# Altium project TK-KB1.PrjPcb
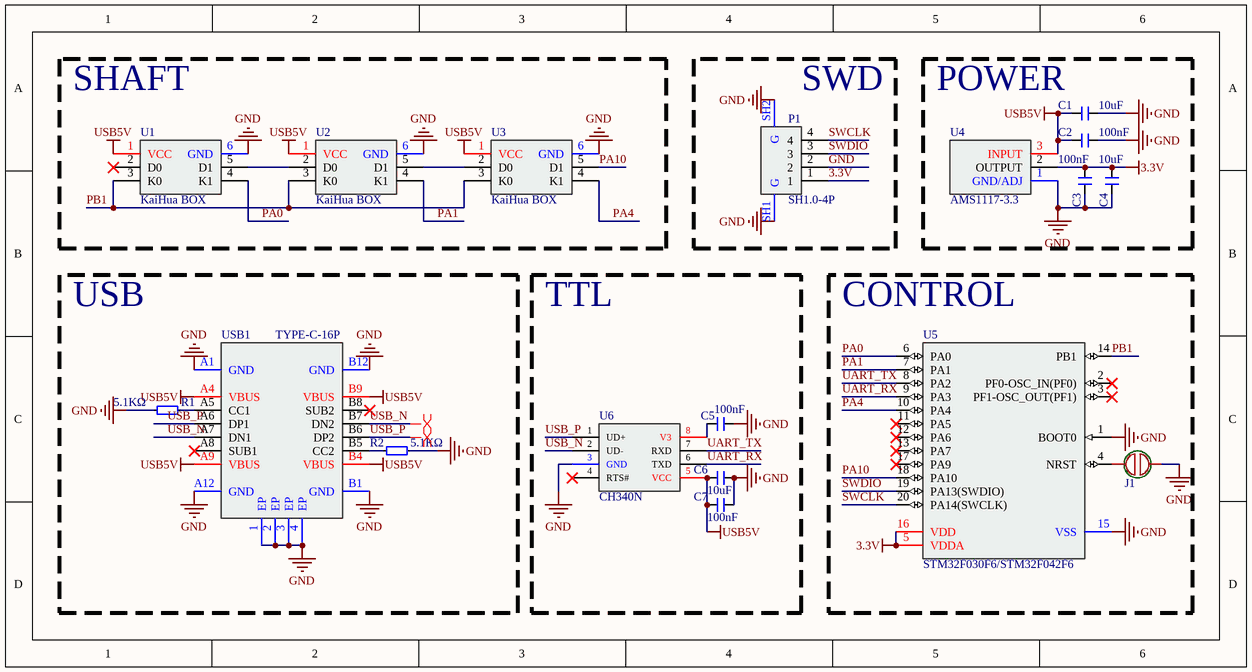
[diagram p0: Schematic.SchDoc]
1 sheet, 18 parts. Net scope: global (net labels, ports and power ports of the same name join across sheets).
Board file: PCB.PcbDoc

## Sheet Schematic.SchDoc
size 233 x 124 mm; SheetNumber: 1; SheetTotal: 1

### Parts
C1  10uF  [C0402]
C2  100nF  [C0402]
C3  100nF  [C0402]
C4  10uF  [C0402]
C5  100nF  [C0402]
C6  10uF  [C0402]
C7  100nF  [C0402]
J1  Jumper  [R0402]  (value not drawn)
P1  SH1.0-4P  [SH1.0-4P]
R1  5.1KΩ  [R0402]
R2  5.1KΩ  [R0402]
U1  KaiHua BOX  [凯华轴座+3528反贴灯]
U2  KaiHua BOX  [凯华轴座+3528反贴灯]
U3  KaiHua BOX  [凯华轴座+3528反贴灯]
U4  AMS1117-3.3  [SOT-89]
U5  STM32F030F6/STM32F042F6  [TSSOP-20]
U6  CH340N  [SOP-8]
USB1  TYPE-C-16P  [TYPE-C-KH Female_LieDown_16P]

### Blocks framed on the sheet
SHAFT: U1-U3
SWD: P1
POWER: C1-C4 U4
USB: R1 R2 USB1
TTL: C5-C7 U6
CONTROL: J1 U5

### Nets
3.3V: C3.2 C4.2 P1.1 U4.2(OUTPUT) U5.5(VDDA) U5.16(VDD)
GND: C1.2 C2.2 C3.1 C4.1 C5.2 C6.2 C7.2 J1.2 P1.2 P1.SH1(G) P1.SH2(G) R1.1 R2.2 U1.6(GND) U2.6(GND) U3.6(GND) U4.1(GND/ADJ) U5.1(BOOT0) U5.15(VSS) U6.3(GND) USB1.1(EP) USB1.2(EP) USB1.3(EP) USB1.4(EP) USB1.A1(GND) USB1.A12(GND) USB1.B1(GND) USB1.B12(GND)
USB5V: C1.1 C2.1 C6.1 C7.1 U1.1(VCC) U2.1(VCC) U3.1(VCC) U4.3(INPUT) U6.5(VCC) USB1.A4(VBUS) USB1.A9(VBUS) USB1.B4(VBUS) USB1.B9(VBUS)
PA0: U1.4(K1) U5.6(PA0)
PA1: U2.4(K1) U5.7(PA1)
PA4: U3.4(K1) U5.10(PA4)
PA10: U3.5(D1) U5.18(PA10)
PB1: U1.3(K0) U2.3(K0) U3.3(K0) U5.14(PB1)
SWCLK: P1.4 U5.20(PA14(SWCLK))
SWDIO: P1.3 U5.19(PA13(SWDIO))
UART_RX: U5.9(PA3) U6.6(TXD)
UART_TX: U5.8(PA2) U6.7(RXD)
USB_N: U6.2(UD-) USB1.A7(DN1) USB1.B7(DN2)
USB_P: U6.1(UD+) USB1.A6(DP1) USB1.B6(DP2)
NetC5_1: C5.1 U6.8(V3)
NetJ1_1: J1.1 U5.4(NRST)
NetR1_2: R1.2 USB1.A5(CC1)
NetR2_1: R2.1 USB1.B5(CC2)
NetU1_5: U1.5(D1) U2.2(D0)
NetU2_5: U2.5(D1) U3.2(D0)

Not connected (* = marked no-connect by the designer): U1 2(D0)*; U5 2(PF0-OSC_IN(PF0))* 3(PF1-OSC_OUT(PF1))* 11(PA5)* 12(PA6)* 13(PA7)* 17(PA9)*; U6 4(RTS#)*; USB1 A8(SUB1)* B8(SUB2)*

### Layout directives
differential pair: USB_N, USB_P

### Library data of the parts
C1-C7 = C0402: 电容-0402
J1 = Jumper: 飞线，0Ω电阻
P1 = SH1.0-4P: SH1.00mm 4P 卧贴
R1 R2 = R0402: 电阻-0402
U1-U3 = KaiHua BOX: 凯华轴座+3528反贴灯，缺口在右下
U4 = AMS1117-3.3 89: 电源IC 降压IC 线性稳压LDO SOT-89封装
U5 = STM32F030F4P6: ARM Cortex-M0 32-bit MCU, 16 KB Flash, 4 KB Internal RAM, 15 I/Os, 20-pin TSSOP, -40 to 85 degC, Tube; FLASH Size (Prog) (kB): 16; I/Os (High Current): 15; Internal RAM Size (kB): 4; Operating Frequency(F) (Processor speed) (MHz): 48; Supply Voltage(Vcc) min (V): 2.4; DatasheetVersion: Rev. 1; PackageVersion: Rev. 1, 11/2012; PackageReference: TSSOP20; PackageDescription: 20-Pin Thin Shrink Small Outline Package, 6.5 x 4.4 mm Body, 0.65 mm Pitch; Supplier 1: Digi-Key; Supplier Part Number 1: 497-14044-5-ND; Supplier 2: Newark; Supplier Part Number 2: 06X3648; Supplier 3: Mouser; Supplier Part Number 3: 511-STM32F030F4P6; Core: ARM Cortex-M0; Packing: Tube; Mounting Technology: Surface Mount; PartNumber: STM32F030F4P6; ComponentLink1Description: Manufacturer URL; ComponentLink1URL: http://www.st.com/web/en/home.html; ComponentLink2Description: Datasheet; ComponentLink2URL: http://www.st.com/st-web-ui/static/active/en/resource/technical/document/datasheet/DM00088500.pdf; ComponentLink3Description: Package Specification; ComponentLink3URL: http://www.st.com/st-web-ui/static/active/en/resource/technical/document/datasheet/DM00065136.pdf
U6 = CH340N: CH340N通讯芯片
USB1 = TYPE-C-KH Female_LieDown_16P: Type-C母座_卧贴_16P